# Altium schematic sheet Outputs.SchDoc
size A4
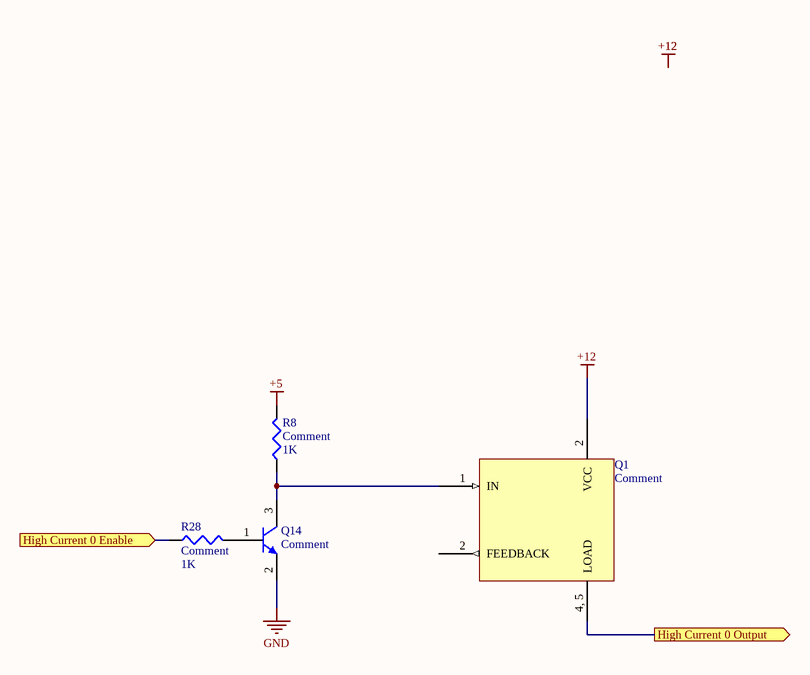
[diagram p0: Outputs.SchDoc]

## Parts
Q1  Comment
Q14  Comment  [SOT23A]
R8  Comment  value 1K  [2012[0805]]
R28  Comment  value 1K  [2012[0805]]

## Ports
High Current 0 Enable (in), High Current 0 Output (out)

## Nets
+5: R8.1
+12: Q1.2(FEEDBACK)
GND: Q14.2(E)
High Current 0 Enable: R28.1 ; port High Current 0 Enable
High Current 0 Output: Q1.4,_5(LOAD) ; port High Current 0 Output
NetQ1_1: Q1.1(IN) Q14.3(C) R8.2
NetQ14_1: Q14.1(B) R28.2

## Library data of the parts
Q1 = AUIR3313STRL
Q14 = CMP-1048-00538-1: General Purpose Transistor, NPN Silicon, 3-Pin SOT-23, Pb-Free, Tape and Reel; Manufacturer: On Semiconductor; PartNumber: MMBT2222ALT1G; fT Min (MHz): 300; IC Continuous (A): 0.6; ComponentLink3URL: http://www.onsemi.cn/pub_link/Collateral/318-08.PDF; RoHS: TRUE; ComponentLink1URL: http://www.onsemi.com/; ComponentLink3Description: Package Specification; ComponentLink2Description: Datasheet; Mounting Technology: Surface Mount; Packing: Tape and Reel; PackageDescription: 3-Pin Small Outline Transistor, Body 2.92 x 1.3 mm, Pitch 0.95 mm; DatasheetVersion: Rev. 10; PackageReference: SOT-23-3-318-08; ComponentLink2URL: http://www.onsemi.cn/pub_link/Collateral/MMBT2222LT1-D.PDF; Polarity: NPN; PackageVersion: Rev. AP, 11/2009; ComponentLink1Description: Manufacturer URL
R8 R28 = Res3: Resistor; Published: 8-Jun-2000; LatestRevisionDate: 29-May-2009; LatestRevisionNote: IPC-7351 Footprint Added.; PackageReference: J1-0603; Publisher: Altium Limited; PackageDescription: Chip Resistor